# Altium schematic sheet module_base.SchDoc
size B; SheetNumber: 1; SheetTotal: 1
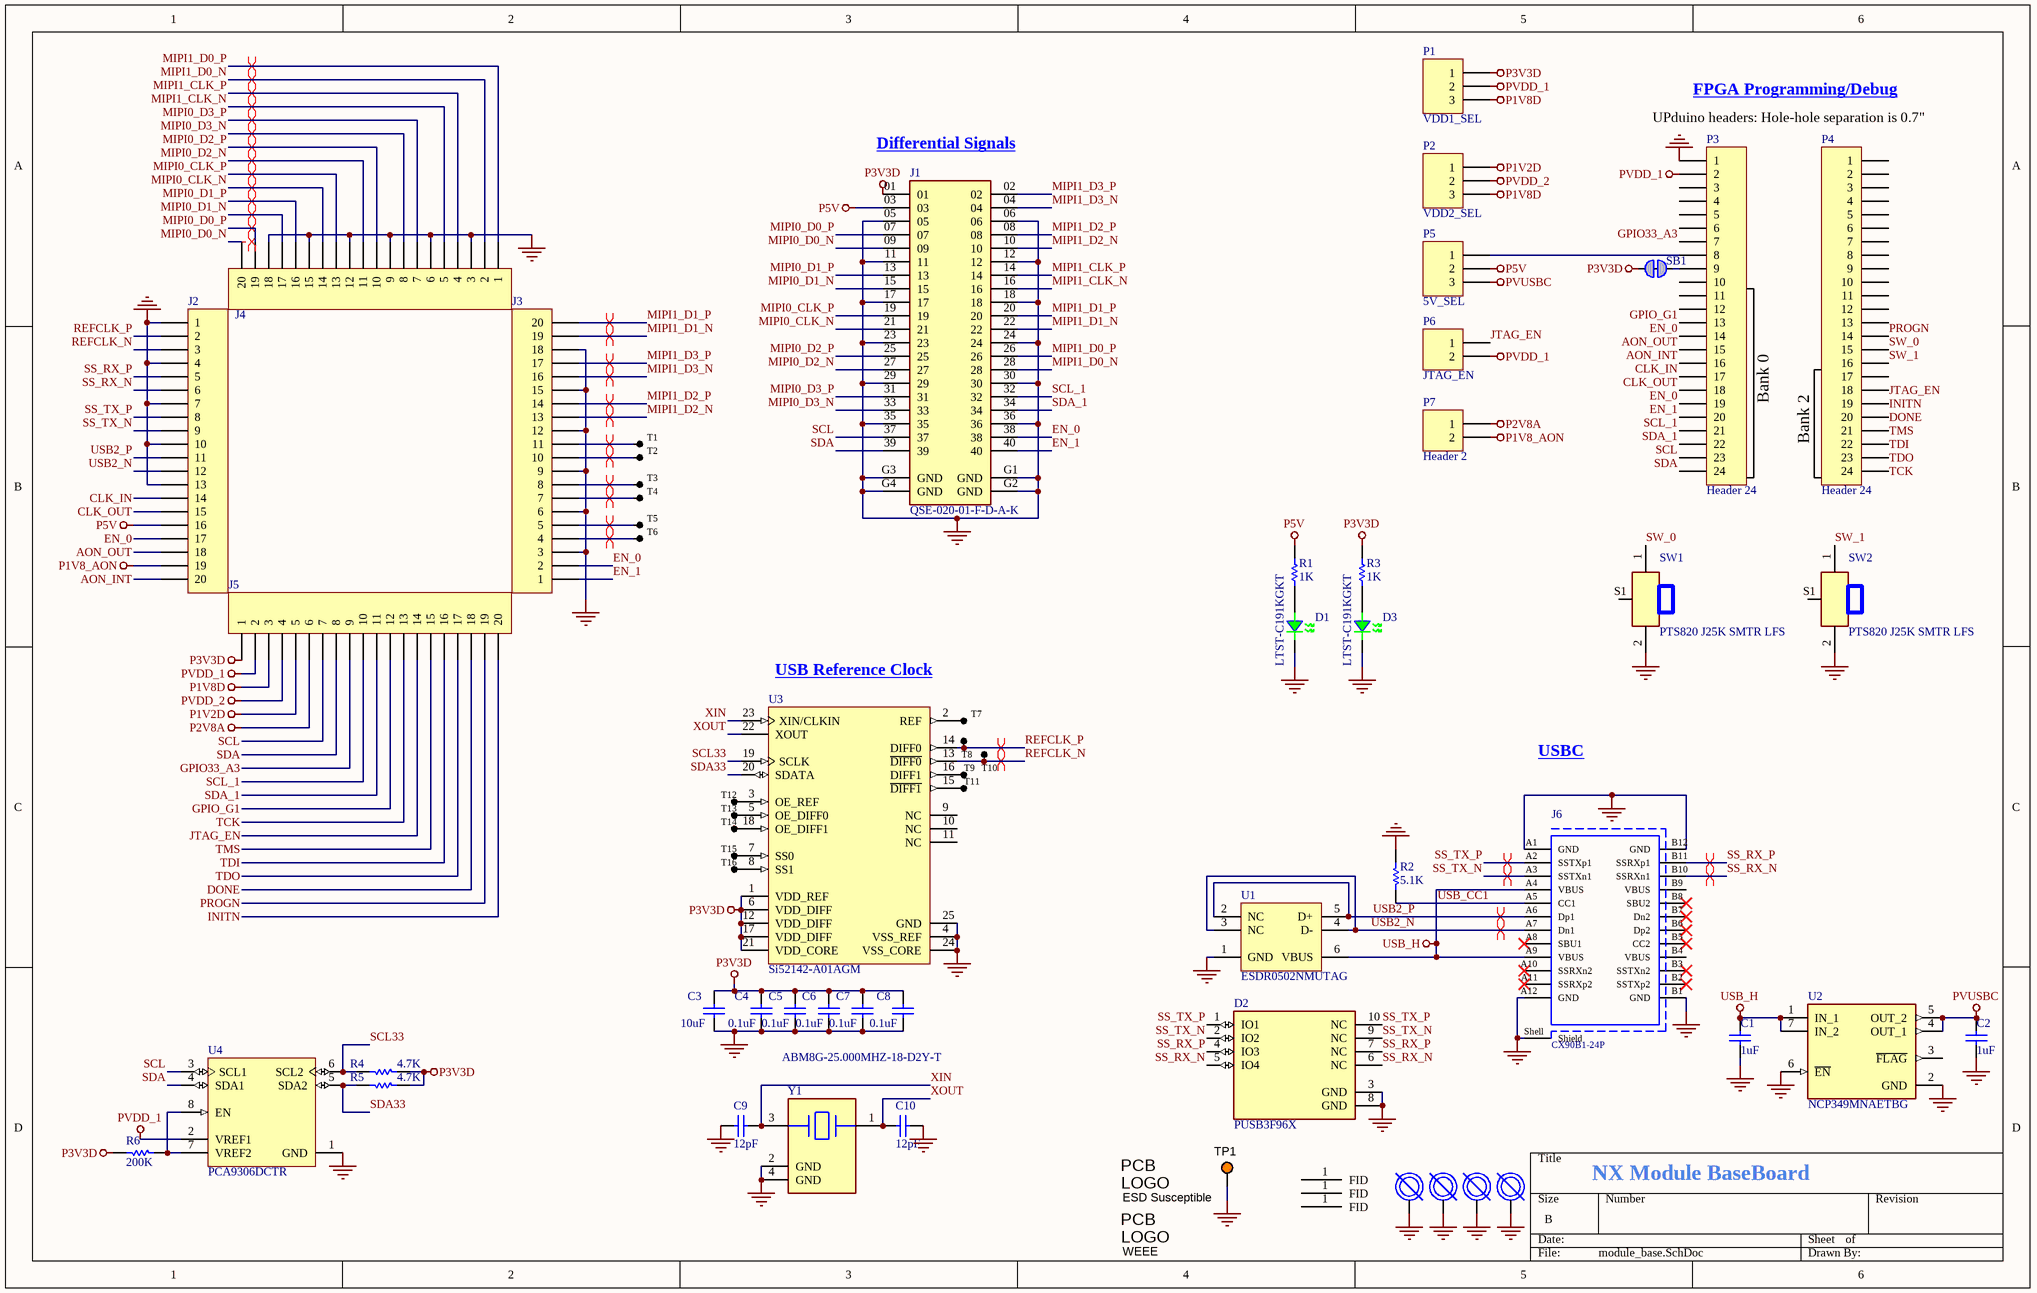
[diagram p0: module_base.SchDoc]

## Parts
BH1  STANDOFF M2.5  [WE_9774010243R]  (value not drawn)
BH2  STANDOFF M2.5  [WE_9774010243R]  (value not drawn)
BH3  STANDOFF M2.5  [WE_9774010243R]  (value not drawn)
BH4  STANDOFF M2.5  [WE_9774010243R]  (value not drawn)
C1  1uF  [CAPC1005X55USR]
C2  1uF  [CAPC1005X55USR]
C3  10uF  [CAPC1005X90]
C4  0.1uF  [CAPC0603X33N]
C5  0.1uF  [CAPC0603X33N]
C6  0.1uF  [CAPC0603X33N]
C7  0.1uF  [CAPC0603X33N]
C8  0.1uF  [CAPC0603X33N]
C9  12pF  [CAPC0603X33N]
C10  12pF  [CAPC0603X33N]
D1  LTST-C191KGKT  [LED_0603]
D2  PUSB3F96X  [DFN2510A-10]
D3  LTST-C191KGKT  [LED_0603]
FID1  (no value)  [FID_040]  (no BOM)
FID2  (no value)  [FID_040]  (no BOM)
FID3  (no value)  [FID_040]  (no BOM)
J1  QSE-020-01-F-D-A-K  [SAMTEC_QSE-020-01-XXX-D-A-L]
J2  Header 20  [HDR1X20_CASTELLATED]  (value not drawn)  (no BOM)
J3  Header 20  [HDR1X20_CASTELLATED]  (value not drawn)  (no BOM)
J4  Header 20  [HDR1X20_CASTELLATED]  (value not drawn)  (no BOM)
J5  Header 20  [HDR1X20_CASTELLATED]  (value not drawn)  (no BOM)
J6  CX90B1-24P  [HRS_CX90B1-24P]
Logo1  WEEE  [WEEE_Minimum]  (no BOM)
Logo2  ESD Susceptible  [ESD_Overlay_Medium]  (no BOM)
P1  VDD1_SEL  [HDR1X3]
P2  VDD2_SEL  [HDR1X3]
P3  Header 24  [HDR1X24]
P4  Header 24  [HDR1X24]
P5  5V_SEL  [HDR1X3]
P6  JTAG_EN  [HDR1X2]
P7  Header 2  [HDR1X2]
R1  1K  [RESC1005X40USR]
R2  5.1K  [RESC1005X40USR]
R3  1K  [RESC1005X40USR]
R4  4.7K  [RESC0603X26N]
R5  4.7K  [RESC0603X26N]
R6  200K  [RESC1005X40USR]
SB1  Solderbridge  [Solderbridge_Shorted]  (value not drawn)  (net tie, no BOM)
SW1  PTS820 J25K SMTR LFS  [PTS820J25MSMTRLFS]
SW2  PTS820 J25K SMTR LFS  [PTS820J25MSMTRLFS]
T1  (no value)  [TP 1mm]  (no BOM)
T2  (no value)  [TP 1mm]  (no BOM)
T3  (no value)  [TP 1mm]  (no BOM)
T4  (no value)  [TP 1mm]  (no BOM)
T5  (no value)  [TP 1mm]  (no BOM)
T6  (no value)  [TP 1mm]  (no BOM)
T7  (no value)  [TP 1mm]  (no BOM)
T8  (no value)  [TP 1mm]  (no BOM)
T9  (no value)  [TP 1mm]  (no BOM)
T10  (no value)  [TP 1mm]  (no BOM)
T11  (no value)  [TP 1mm]  (no BOM)
T12  (no value)  [TP 1mm]  (no BOM)
T13  (no value)  [TP 1mm]  (no BOM)
T14  (no value)  [TP 1mm]  (no BOM)
T15  (no value)  [TP 1mm]  (no BOM)
T16  (no value)  [TP 1mm]  (no BOM)
TP1  5019  [TP380X203]  (value not drawn)
U1  ESDR0502NMUTAG  [ONSC-UDFN-6-517AA-01_V]
U2  NCP349MNAETBG  [SON50P200X160X100-7N-D]
U3  Si52142-A01AGM  [SLAB-QFN-24-2700x2700TP_M]
U4  PCA9306DCTR  [SOP65P400X130-8N]
Y1  ABM8G-25.000MHZ-18-D2Y-T  [XTAL_ABM8G3225X10]

## Nets
GND: BH1.1 BH2.1 BH3.1 BH4.1 C1.1 C2.1 C3.1 C4.1 C5.1 C6.1 C7.1 C8.1 C9.2 C10.2 D1.2(K) D2.3(GND) D2.8(GND) D3.2(K) J1.05 J1.06 J1.11 J1.12 J1.17 J1.18 J1.23 J1.24 J1.29 J1.30 J1.35 J1.36 J1.G1(GND) J1.G2(GND) J1.G3(GND) J1.G4(GND) J2.1 J2.4 J2.7 J2.10 J2.13 J3.3 J3.6 J3.9 J3.12 J3.15 J3.18 J4.3 J4.6 J4.9 J4.12 J4.15 J4.18 J6.A1(GND) J6.A12(GND) J6.B1(GND) J6.B12(GND) J6.Shell(Shield) P3.1 R2.2 SW1.2 SW2.2 TP1.1 U1.1(GND) U2.2(GND) U2.6(~{EN}) U3.4(VSS_REF) U3.24(VSS_CORE) U3.25(GND) U4.1(GND) Y1.2(GND) Y1.4(GND)
P1V2D: J5.5 P2.1
P1V8_AON: J2.19 P7.2
P1V8D: J5.3 P1.3 P2.3
P2V8A: J5.6 P7.1
P3V3D: C3.2 C4.2 C5.2 C6.2 C7.2 C8.2 J1.01 J5.1 P1.1 R3.1 R4.2 R5.2 R6.2 SB1.1 U3.1(VDD_REF) U3.6(VDD_DIFF) U3.12(VDD_DIFF) U3.17(VDD_DIFF) U3.21(VDD_CORE)
P5V: J1.03 J2.16 P5.2 R1.1
PVDD_1: J5.2 P1.2 P3.2 P6.2 U4.2(VREF1)
PVDD_2: J5.4 P2.2
PVUSBC: C2.2 P5.3 U2.4(OUT_1) U2.5(OUT_2)
USB_H: C1.2 J6.A4(VBUS) J6.A9(VBUS) U1.6(VBUS) U2.1(IN_1) U2.7(IN_2)
AON_INT: J2.20 P3.16
AON_OUT: J2.18 P3.15
CLK_IN: J2.14 P3.17
CLK_OUT: J2.15 P3.18
DONE: J5.18 P4.20
EN_0: J1.38 J2.17 J3.2 P3.14 P3.19
EN_1: J1.40 J3.1 P3.20
GPIO33_A3: J5.9 P3.7
GPIO_G1: J5.12 P3.13
INITN: J5.20 P4.19
JTAG_EN: J5.14 P4.18 P6.1
MIPI0_CLK_N: J1.21 J4.14
MIPI0_CLK_P: J1.19 J4.13
MIPI0_D0_N: J1.09 J4.20
MIPI0_D0_P: J1.07 J4.19
MIPI0_D1_N: J1.15 J4.17
MIPI0_D1_P: J1.13 J4.16
MIPI0_D2_N: J1.27 J4.11
MIPI0_D2_P: J1.25 J4.10
MIPI0_D3_N: J1.33 J4.8
MIPI0_D3_P: J1.31 J4.7
MIPI1_CLK_N: J1.16 J4.5
MIPI1_CLK_P: J1.14 J4.4
MIPI1_D0_N: J1.28 J4.2
MIPI1_D0_P: J1.26 J4.1
MIPI1_D1_N: J1.22 J3.19
MIPI1_D1_P: J1.20 J3.20
MIPI1_D2_N: J1.10 J3.13
MIPI1_D2_P: J1.08 J3.14
MIPI1_D3_N: J1.04 J3.16
MIPI1_D3_P: J1.02 J3.17
PROGN: J5.19 P4.14
REFCLK_N: J2.3 T10.1 U3.13(~{DIFF0})
REFCLK_P: J2.2 T8.1 U3.14(DIFF0)
SCL: J1.37 J5.7 P3.23 U4.3(SCL1)
SCL33: R4.1 U3.19(SCLK) U4.6(SCL2)
SCL_1: J1.32 J5.10 P3.21
SDA: J1.39 J5.8 P3.24 U4.4(SDA1)
SDA33: R5.1 U3.20(SDATA) U4.5(SDA2)
SDA_1: J1.34 J5.11 P3.22
SS_RX_N: D2.5(IO4) D2.6(NC) J2.6 J6.B10(SSRXn1)
SS_RX_P: D2.4(IO3) D2.7(NC) J2.5 J6.B11(SSRXp1)
SS_TX_N: D2.2(IO2) D2.9(NC) J2.9 J6.A3(SSTXn1)
SS_TX_P: D2.1(IO1) D2.10(NC) J2.8 J6.A2(SSTXp1)
SW_0: P4.15 SW1.1
SW_1: P4.16 SW2.1
TCK: J5.13 P4.24
TDI: J5.16 P4.22
TDO: J5.17 P4.23
TMS: J5.15 P4.21
USB2_N: J2.12 J6.A7(Dn1) U1.3(NC) U1.4(D-)
USB2_P: J2.11 J6.A6(Dp1) U1.2(NC) U1.5(D+)
USB_CC1: J6.A5(CC1) R2.1
XIN: C9.1 U3.23(XIN/CLKIN) Y1.3
XOUT: C10.1 U3.22(XOUT) Y1.1
NetD1_1: D1.1(A) R1.2
NetD3_1: D3.1(A) R3.2
NetJ3_4: J3.4 T6.1
NetJ3_5: J3.5 T5.1
NetJ3_7: J3.7 T4.1
NetJ3_8: J3.8 T3.1
NetJ3_10: J3.10 T2.1
NetJ3_11: J3.11 T1.1
NetP3_8: P3.8 P5.1
NetP3_9: P3.9 SB1.2
NetR6_1: R6.1 U4.7(VREF2) U4.8(EN)
NetT7_1: T7.1 U3.2(REF)
NetT9_1: T9.1 U3.16(DIFF1)
NetT11_1: T11.1 U3.15(~{DIFF1})
NetT12_1: T12.1 U3.3(OE_REF)
NetT13_1: T13.1 U3.5(OE_DIFF0)
NetT14_1: T14.1 U3.18(OE_DIFF1)
NetT15_1: T15.1 U3.7(SS0)
NetT16_1: T16.1 U3.8(SS1)

Not connected (* = marked no-connect by the designer): FID1 1(FID); FID2 1(FID); FID3 1(FID); J6 A8(SBU1)* A10(SSRXn2)* A11(SSRXp2)* B2(SSTXp2)* B3(SSTXn2)* B4(VBUS) B5(CC2)* B6(Dp2)* B7(Dn2)* B8(SBU2)* B9(VBUS); P3 3 4 5 6 10 11 12; P4 1 2 3 4 5 6 7 8 9 10 11 12 13 17; SW1 S1(GND); SW2 S1(GND); U2 3(~{FLAG}); U3 9(NC) 10(NC) 11(NC)

## Layout directives
differential pair: MIPI0_CLK_N, MIPI0_CLK_P, MIPI0_D0_N, MIPI0_D0_P, MIPI0_D1_N, MIPI0_D1_P, MIPI0_D2_N, MIPI0_D2_P, MIPI0_D3_N, MIPI0_D3_P, MIPI1_CLK_N, MIPI1_CLK_P, MIPI1_D0_N, MIPI1_D0_P, MIPI1_D1_N, MIPI1_D1_P, MIPI1_D2_N, MIPI1_D2_P, MIPI1_D3_N, MIPI1_D3_P, NetJ3_4, NetJ3_5, NetJ3_7, NetJ3_8, NetJ3_10, NetJ3_11, REFCLK_N, REFCLK_P, SS_RX_N, SS_RX_P, SS_TX_N, SS_TX_P, USB2_N, USB2_P

## Notes on the sheet
- FPGA Programming/Debug
- (near J1) Differential Signals
- UPduino headers: Hole-hole separation is 0.7"
- (near P3) Bank 0
- (near P4) Bank 2
- USB Reference Clock
- USBC
- NX Module BaseBoard
- (in symbol Logo ESD) PCB; LOGO
- (in symbol Logo WEEE) PCB; LOGO

## Library data of the parts
BH1-BH4 = MOUNT_HOLE: ROUND STANDOFF M2X0.4 STEEL 1MM; Manufacturer Part Number: 9774010243R; Manufacturer: Würth Elektronik; Supplier Part Number 1: 732-7065-2-ND; Supplier 1: Digi-Key
C1 C2 = CAP CER 1UF 25V X5R 0402: Manufacturer Part Number: GRM155R61E105MA12D; Manufacturer: Murata Electronics; Part #: E-CAP-042; value: 1uF; Supplier Part Number 1: 490-10018-1-ND; Package: 0402; Supplier 1: Digi-Key; Height: 0.55mm; ComponentLink1Description: New link; ComponentLink1URL: *
C3 = Cap_1uF_X5R_10%_6V3_0402: CAP CER 10UF 10V X5R 0402; Manufacturer Part Number: CL05A106MP8NUB8; Manufacturer: Samsung Electro-Mechanics; Part #: E-CAP-042; Supplier Part Number 1: 1276-6830-1-ND; Package: 0402; value: 10uF; Supplier 1: Digi-Key; Height: 0.9mm; ComponentLink1Description: New link; ComponentLink1URL: *
C4-C8 = CAP CER 0.1UF 10V X7S 0201: Manufacturer Part Number: C0603X7S1A104K030BC; Manufacturer: TDK Corporation; Supplier Part Number 1: 445-9051-2-ND; Package: 0201; Height: 0.33mm; Supplier 1: Digi-Key; value: 0.1uF
C9 C10 = CAP CER 12PF 50V C0G 0201: Manufacturer Part Number: C0603C0G1H120K030BA; Manufacturer: TDK Corporation; Supplier Part Number 1: 445-13641-2-ND; Package: 0201; Height: 0.33mm; Supplier 1: Digi-Key; value: 12pF
D1 D3 = 0603LED_GRN: LED GREEN CLEAR CHIP 0603 SMD; Manufacturer: Lite-On Inc.; Manufacturer Part Number: LTST-C191GKT; Unit Cost, Qty 1: $0.68; Unit Cost, Qty 500: $0.293; Supplier Part Number 1: 160-1443-1-ND; Value: LTST-C191KGKT; Supplier 1: Digi-Key
D2 = PUSB3F96X: TVS DIODE 5.5VWM 4.6VC DFN2510A; Manufacturer: Nexperia USA Inc.; Interface: USB; Manufacturer Part Number: PUSB3F96X; Supplier 1: Digi-Key; Supplier Part Number 1: 1727-2030-1-ND
FID1-FID3 = FID: Notes: DNP
J1 = QSE-020-01-F-D-A-K: Q Strip® High-Speed Ground Plane Header, 0.80mm Pitch; Manufacturer: Samtec; Manufacturer Part Number: QTE-020-01-F-D-A; Number of Positions: 40; Gender: Male; Pitch: 0.031inch; Mated Stacking Heights: 5mm; Supplier: Digi-Key; Supplier Part Number: SAM8846-ND; RoHS: Yes; Category: Board to Board Connectors; Stock: 1329; Pricing: 1=9.48000, 10=8.53000, 25=8.03560, 40=7.82950, 96=7.62344, 288=6.79931, 480=6.38725, 960=5.64550 (USD); Mounting Technology: Surface Mount; Contact Plating: Gold; Number of Rows: 2; Packaging: Tray; Termination: Solder; Number of Contacts: 40; Series: QStrip® QTE; Package Quantity: 1; RoHS Compliant: Yes; ComponentLink1URL: https://datasheet.ciiva.com/6924/qte-xxx-xx-x-d-xxx-mkt-6924765.pdf?src-supplier=Digi-Key; ComponentLink1Description: https://datasheet.ciiva.com/6924/qte-xxx-xx-x-d-xxx-mkt-6924765.pdf?src-supplier=Digi-Key
J2-J5 = Header 20: Header, 20-Pin; LatestRevisionDate: 17-Jul-2002; LatestRevisionNote: Re-released for DXP Platform.; Publisher: Altium Limited
J6 = USB 3.1_HRS_CX90B1-24P: CONN RCP USB3.1 TYPEC 24P SMD RA; Manufacturer: Hirose Electric Co Ltd; Number of Contacts: 24; Supplier 1: Digi-Key; Supplier Part Number 1: H125778CT-ND; Manufacturer Part Number: CX90B1-24P; ComponentLink1URL: https://www.mouser.com/ds/2/445/632723x00011-782157.pdf?src-supplier=Mouser; ComponentLink1Description: https://www.mouser.com/ds/2/445/632723x00011-782157.pdf?src-supplier=Mouser; ComponentLink2URL: https://katalog.we-online.de/em/datasheet/632723x00011.pdf?src-supplier=Digi-Key; ComponentLink2Description: https://katalog.we-online.de/em/datasheet/632723x00011.pdf?src-supplier=Digi-Key
Logo1 = Logo WEEE: WEEE logo; Library Reference: WEEE logo; Lib Reference: WEEE logo; PartNumber: WEEE logo
Logo2 = Logo ESD: ESD Susceptible Symbol; Library Reference: Logo; SymbolCreator: a0412235; Lib Reference: ESD_Susceptible; Publisher: Texas Instruments; SymbolVersion: 2011-08-22; Published: 2009-03-03; LatestRevisionDate: 2017-07-06; PartNumber: ESD Susceptible
P1 P2 P5 = Header 3: Header, 3-Pin; LatestRevisionDate: 17-Jul-2002; LatestRevisionNote: Re-released for DXP Platform.; Publisher: Altium Limited
P3 P4 = Header 24: Header, 24-Pin; LatestRevisionDate: 17-Jul-2002; LatestRevisionNote: Re-released for DXP Platform.; Publisher: Altium Limited
P6 P7 = Header 2: Header, 2-Pin; LatestRevisionDate: 17-Jul-2002; LatestRevisionNote: Re-released for DXP Platform.; Publisher: Altium Limited
R1 R3 = RES 1K OHM 1% 1/16W 0402: RES SMD 1K OHM 1% 1/16W 0402; Manufacturer: YAGEO; Manufacturer Part Number: RC0402FR-071KL; Supplier Part Number 1: 311-1.00KLRCT-ND; Package: 0402; Height: 0.4mm; Supplier 1: Digi-Key; value: 1K
R2 = RES 5.1K OHM 1% 1/16W 0402: RES SMD 5.1K OHM 1% 1/16W 0402; Manufacturer: YAGEO; Manufacturer Part Number: RC0402FR-075K1L; Supplier Part Number 1: 311-5.10KLRCT-ND; Package: 0402; Height: 0.4mm; Supplier 1: Digi-Key; value: 5.1K
R4 R5 = RES 4.7K OHM 1% 1/20W 0201: Manufacturer: Yageo; Manufacturer Part Number: RC0201FR-074K7L; Supplier Part Number 1: 311-4.70KMTR-ND; Package: 0201; Height: 0.26mm; Supplier 1: Digi-Key; value: 4.7K
R6 = Res_10K_1%_0402: RES SMD 200K OHM 1% 1/16W 0402; Manufacturer: Stackpole Electronics Inc; Manufacturer Part Number: RMCF0402FT200K; Supplier Part Number 1: RMCF0402FT200KTR-ND; Package: 0402; Height: 0.4mm; Supplier 1: Digi-Key; value: 200K
SB1 = Solderbridge Shorted: Shorted Solderbridge; Artikkelnr Noca: N.A.; Part Number: Solderbridge Shorted; Manufacturer: *; Manufacturer Part Number: *; Datasheet: *; LatestRevisionDate: 2012-08-07; Pin Count: 2; Publisher: Nordic Semiconductor; Published: 2012-08-07; Value: Solderbridge; Note: *; Supplier: *; Supplier part number: *; 2nd source Supplier: *; 2nd source part number: *; Footprint Doc: Solderbridge_Shorted; Artikkelnr Simpro: N.A.
SW1 SW2 = SPST_NO: SWITCH TACTILE SPST-NO 0.05A 12V; Manufacturer: C&K; Supplier Part Number 1: CKN10897CT-ND; Supplier 1: Digi-Key; Manufacturer Part Number: PTS820 J25K SMTR LFS
T1-T16 = TP_S: test point
TP1 = 5019: PC TEST POINT MINIATURE; Manufacturer: Keystone Electronics; Supplier Part Number 1: 36-5019CT-ND; Manufacturer Part Number: 5019; ComponentLink2URL: http://keyelco.com/userAssets/file/M65p56.pdf; Supplier 1: Digi-Key; ComponentLink1Description: Manufacturer URL; ComponentLink1URL: http://www.keyelco.com/; ComponentLink2Description: Datasheet
U1 = ONSC-ESDR0502N-UDFN-6-517AA-01: TVS DIODE 5.5VWM 6UDFN; Manufacturer: ON Semiconductor; ComponentLink2URL: http://www.onsemi.cn/pub_link/Collateral/ESDR0502N-D.PDF; ComponentLink3URL: http://www.onsemi.com/pub_link/Collateral/517AA.PDF; ComponentLink1Description: Manufacturer URL; ComponentLink2Description: Datasheet; ComponentLink3Description: Package Specification; ComponentLink1URL: http://www.onsemi.com/; Supplier Part Number 1: 863-ESDR0502NMUTAG; Manufacturer Part Number: ESDR0502NMUTAG; Supplier 1: Mouser
U2 = NCP349MNAETBG: IC CTLR OVP 28V W/NMOS 6-DFN; Manufacturer: ON Semiconductor; Min Supply Voltage: 1.2V; Operating Supply Current: 70uA; Height: 0.95mm; Supplier 1: Digi-Key; Manufacturer Part Number: NCP349MNAETBG; RoHS: Yes; Category: Power Management ICs; Stock 1: 1255; Pricing 1: 1=0.96000, 10=0.84700, 25=0.79520, 100=0.64900, 250=0.60284, 500=0.51304, 1000=0.41043 (USD); Mount: Surface Mount; Case/Package: DFN; Number of Pins: 6; Weight: 0.000744oz; Min Operating Temperature: -40°C; Max Operating Temperature: 85°C; Packaging: Tape and Reel; Package Quantity: 3000; Max Supply Voltage: 28V; Series: -; Length: 2mm; Width: 1.6mm; Reach SVHC Compliant: Yes; Lead Free: Lead Free; Halogen Free: Halogen Free; RoHS Compliant: Yes; ComponentLink1URL: https://datasheet.ciiva.com/1967/ncp349-d-1967888.pdf?src-supplier=Avnet; ComponentLink1Description: https://datasheet.ciiva.com/1967/ncp349-d-1967888.pdf?src-supplier=Avnet; ComponentLink2URL: https://datasheet.ciiva.com/6602/ncp349-d-6602421.pdf?src-supplier=Digi-Key; ComponentLink2Description: https://datasheet.ciiva.com/6602/ncp349-d-6602421.pdf?src-supplier=Digi-Key; ComponentLink3URL: https://datasheet.ciiva.com/6602/ncp349-d-6602425.pdf?src-supplier=Digi-Key; ComponentLink3Description: https://datasheet.ciiva.com/6602/ncp349-d-6602425.pdf?src-supplier=Digi-Key; Supplier Part Number 1: NCP349MNAETBGOSCT-ND
U3 = CMP-0510-00262-1: PCI-Express Gen 1, Gen 2, & Gen 3 Two Output Clock Generator with 25 MHz Reference Clock, 3.3 V, 100 MHz Max Output, -40 to 85 degC, 24-pin QFN; Manufacturer: Silicon Labs; VDD: 3.3 V; Reference Inputs: 1; Sub-Family: Clock Generators; Output Format: HSCL; LVCMOS; Output Frequency (MHz): 25; 100; ComponentLink1URL: http://www.silabs.com/; ComponentLink2Description: Datasheet; PackageReference: QFN-24; Mounting Technology: Surface Mount; ComponentLink3Description: Package Specification; Code_JEDEC: MO-220; ComponentLink3URL: http://www.silabs.com/Support%20Documents/TechnicalDocs/Si53152.pdf; DatasheetVersion: Rev. 1.1; ComponentLink1Description: Manufacturer URL; Code_IPC: J-STD-020; PackageDescription: 24-Pin Quad-Flat No-Leads Package, Body 4 x 4 mm, Pitch 0.5 mm; ComponentLink2URL: http://www.silabs.com/Support%20Documents/TechnicalDocs/Si52142.pdf; PartNumber: Si52142-A01AGM
U4 = TI-PCA9306-SM8_DCT-8: Dual Bi-Directional I2C-Bus and SMBus Voltage Level-Translator, 0 to 5.5 V, -40 to 85 degC, 8-pin SM8 (DCT), Green (RoHS & no Sb/Br); Manufacturer: Texas Instruments; Propagation Delay: 900ps; Max Supply Voltage: 5V; Min Supply Voltage: 0V; Number of Channels: 2; Turn-On Delay Time: 1.2ns; Output Type: I2C; Output Current: 64mA; Channel Type: Bidirectional; Number of Circuits: 1; Supplier 1: Digi-Key; Supplier Part Number 1: 296-18509-1-ND; Manufacturer Part Number: PCA9306DCTR; RoHS: Yes; Category: Logic ICs; Stock: 31441; Pricing: 1=0.67000, 10=0.59100, 25=0.55480, 100=0.45290, 250=0.42072, 500=0.35804, 1000=0.28644 (USD); Case/Package: SSOP; Pins: 8; Weight: 0.000825oz; Min Operating Temperature: -40°C; Max Operating Temperature: 85°C; Packaging: Tape and Reel; Number of Outputs: 2; Logic Function: Translator; Series: -; Package Quantity: 1; Number of Bits: 2; Number of Inputs: 2; Lead Free: Lead Free; RoHS Compliant: Yes; Reach SVHC Compliant: No; ComponentLink1URL: https://datasheet.ciiva.com/4834/scps113j-102472-4834081.pdf?src-supplier=Mouser; ComponentLink1Description: https://datasheet.ciiva.com/4834/scps113j-102472-4834081.pdf?src-supplier=Mouser; ComponentLink2URL: https://datasheet.ciiva.com/1899/pca9306-1899333.pdf?src-supplier=Digi-Key; ComponentLink2Description: https://datasheet.ciiva.com/1899/pca9306-1899333.pdf?src-supplier=Digi-Key; ComponentLink3URL: https://datasheet.ciiva.com/1899/pca9306-1899332.pdf?src-supplier=Digi-Key; ComponentLink3Description: https://datasheet.ciiva.com/1899/pca9306-1899332.pdf?src-supplier=Digi-Key; ComponentLink4URL: https://datasheet.ciiva.com/1899/pca9306-1899334.pdf?src-supplier=Digi-Key; ComponentLink4Description: https://datasheet.ciiva.com/1899/pca9306-1899334.pdf?src-supplier=Digi-Key
Y1 = 48e526d86b7f2615d98721063c72f49: Crystal 25MHz ±20ppm (Tol) ±30ppm (Stability) 18pF FUND 60Ohm 4-Pin Ultra Mini-CSMD T/R; Manufacturer: Abracon; ESR (Equivalent Series Resistance): 60R; Supplier 1: Arrow Electronics; Supplier Part Number 1: ABM8G-25.000MHZ-18-D2Y-T; Manufacturer Part Number: ABM8G-25.000MHZ-18-D2Y-T; RoHS: Yes; Category: Crystals; Stock: 31000; Pricing: 1000=0.24370, 2000=0.22880, 4000=0.22080, 6000=0.21970 (USD); Mounting Technology: Surface Mount; Case/Package: CSMD; Pins: 4; Min Operating Temperature: -40°C; Max Operating Temperature: 85°C; Frequency: 25MHz; Load Capacitance: 18pF; Packaging: Tape and Reel; Package Quantity: 1000; Tolerance: 20ppm; Frequency Tolerance: 20ppm; Frequency Stability: 30ppm; Termination: SMD/SMT; ESR: 60R; Series: ABM8G; Operating Frequency: 25 MHz; Length: 3.2mm; Width: 0.098inch; Height: 0.039inch; Depth: 2.5mm; Radiation Hardening: No; Lead Free: Lead Free; Reach SVHC Compliant: Unknown; ComponentLink1URL: https://datasheet.ciiva.com/15116/getdatasheetpartid-719795-15116706.pdf?src-supplier=Verical; ComponentLink1Description: https://datasheet.ciiva.com/15116/getdatasheetpartid-719795-15116706.pdf?src-supplier=Verical; ComponentLink2URL: https://datasheet.ciiva.com/860/abm8g-860745.pdf?src-supplier=Digi-Key; ComponentLink2Description: https://datasheet.ciiva.com/860/abm8g-860745.pdf?src-supplier=Digi-Key; ComponentLink3URL: https://datasheet.ciiva.com/860/abm8g-860746.pdf?src-supplier=Digi-Key; ComponentLink3Description: https://datasheet.ciiva.com/860/abm8g-860746.pdf?src-supplier=Digi-Key; ComponentLink4URL: https://datasheet.ciiva.com/860/abm8g-860747.pdf?src-supplier=Digi-Key; ComponentLink4Description: https://datasheet.ciiva.com/860/abm8g-860747.pdf?src-supplier=Digi-Key; ComponentLink5URL: https://datasheet.ciiva.com/3176/abm8g-3176077.pdf?src-supplier=Avnet; ComponentLink5Description: https://datasheet.ciiva.com/3176/abm8g-3176077.pdf?src-supplier=Avnet; ComponentLink6URL: https://datasheet.ciiva.com/7998/abm8-7998634.pdf?src-supplier=Element14; ComponentLink6Description: https://datasheet.ciiva.com/7998/abm8-7998634.pdf?src-supplier=Element14; ComponentLink7URL: https://datasheet.ciiva.com/28508/1883677-28508583.pdf?src-supplier=Element14; ComponentLink7Description: https://datasheet.ciiva.com/28508/1883677-28508583.pdf?src-supplier=Element14